# EAGLE design espcam (EAGLE 9.6.2)
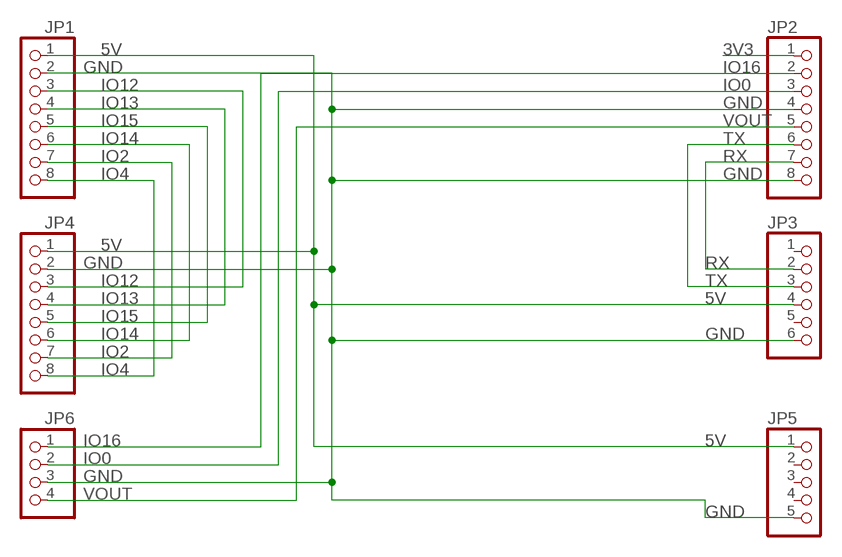
[diagram p0: schematic, sheet 1]

## Parts
JP1  PINHD-1X8  [1X08]
JP2  PINHD-1X8  [1X08]
JP3  PINHD-1X6  [1X06]
JP4  PINHD-1X8  [1X08]
JP5  PINHD-1X5  [1X05]
JP6  PINHD-1X4  [1X04]

## Nets
3V3: JP2.1
5V: JP1.1 JP3.4 JP4.1 JP5.1
GND: JP1.2 JP2.4 JP2.8 JP3.6 JP4.2 JP5.5 JP6.3
IO0: JP2.3 JP6.2
IO2: JP1.7 JP4.7
IO4: JP1.8 JP4.8
IO12: JP1.3 JP4.3
IO13: JP1.4 JP4.4
IO14: JP1.6 JP4.6
IO15: JP1.5 JP4.5
IO16: JP2.2 JP6.1
RX: JP2.7 JP3.2
TX: JP2.6 JP3.3
VOUT: JP2.5 JP6.4
Unconnected: JP3.1 JP3.5 JP5.2 JP5.3 JP5.4

## Library data of the parts
JP1 JP2 JP4 = pinhead:PINHD-1X8: PIN HEADER
JP3 = pinhead:PINHD-1X6: PIN HEADER
JP5 = pinhead:PINHD-1X5: PIN HEADER
JP6 = pinhead:PINHD-1X4: PIN HEADER

## Board
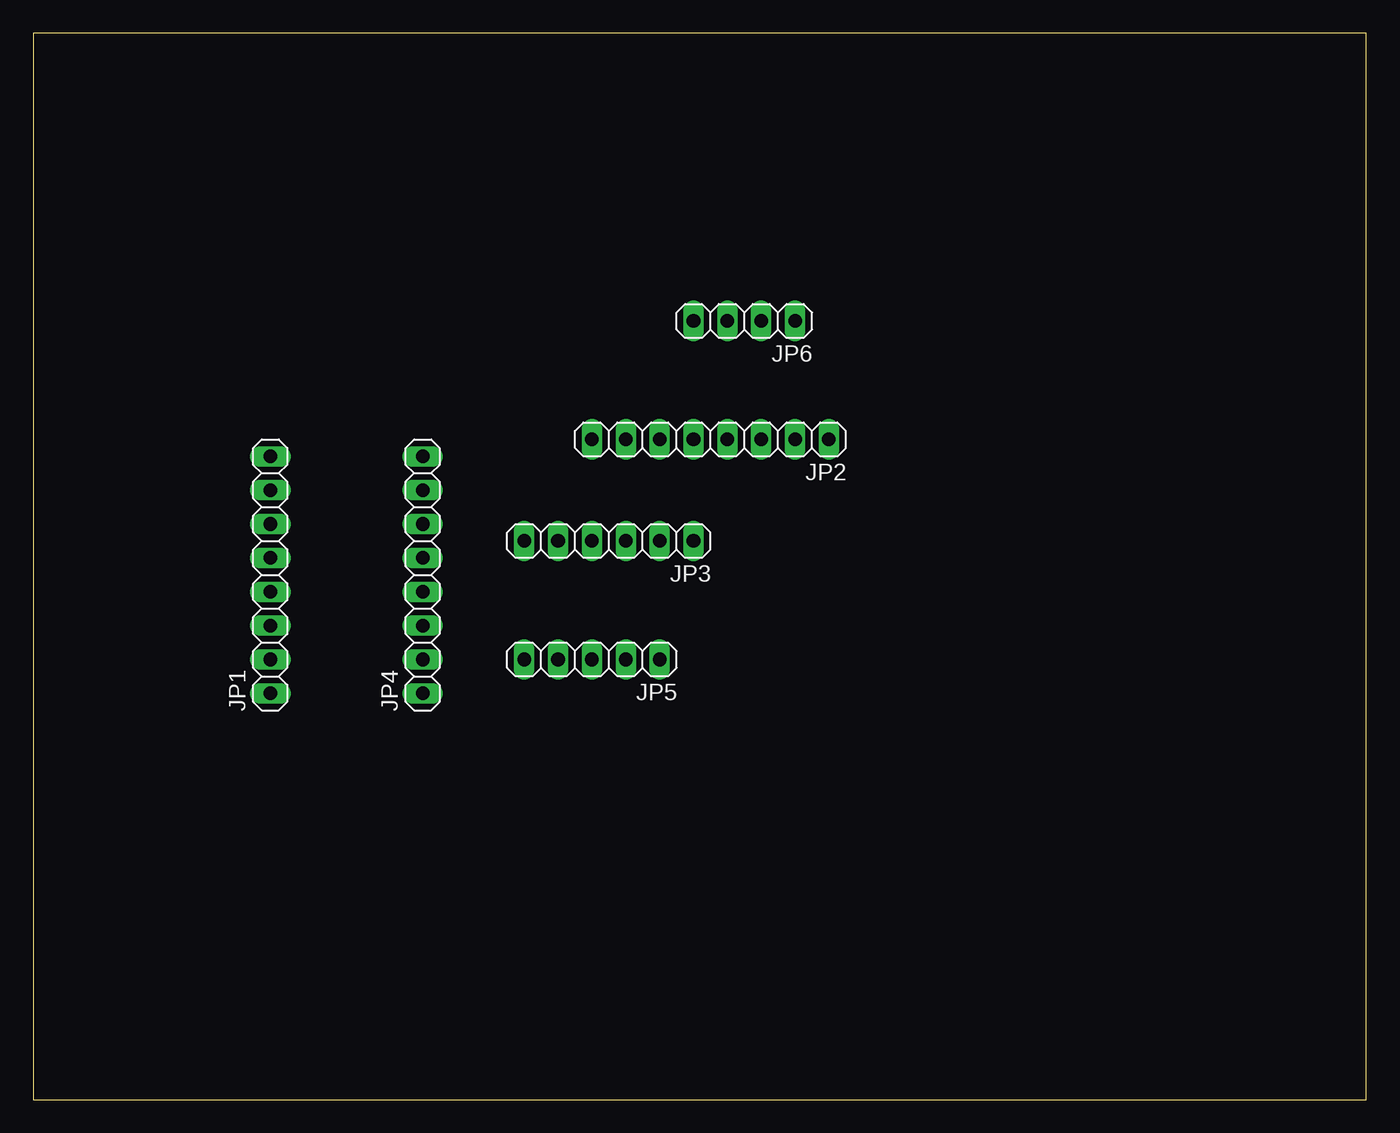
[diagram p1: board, top side]
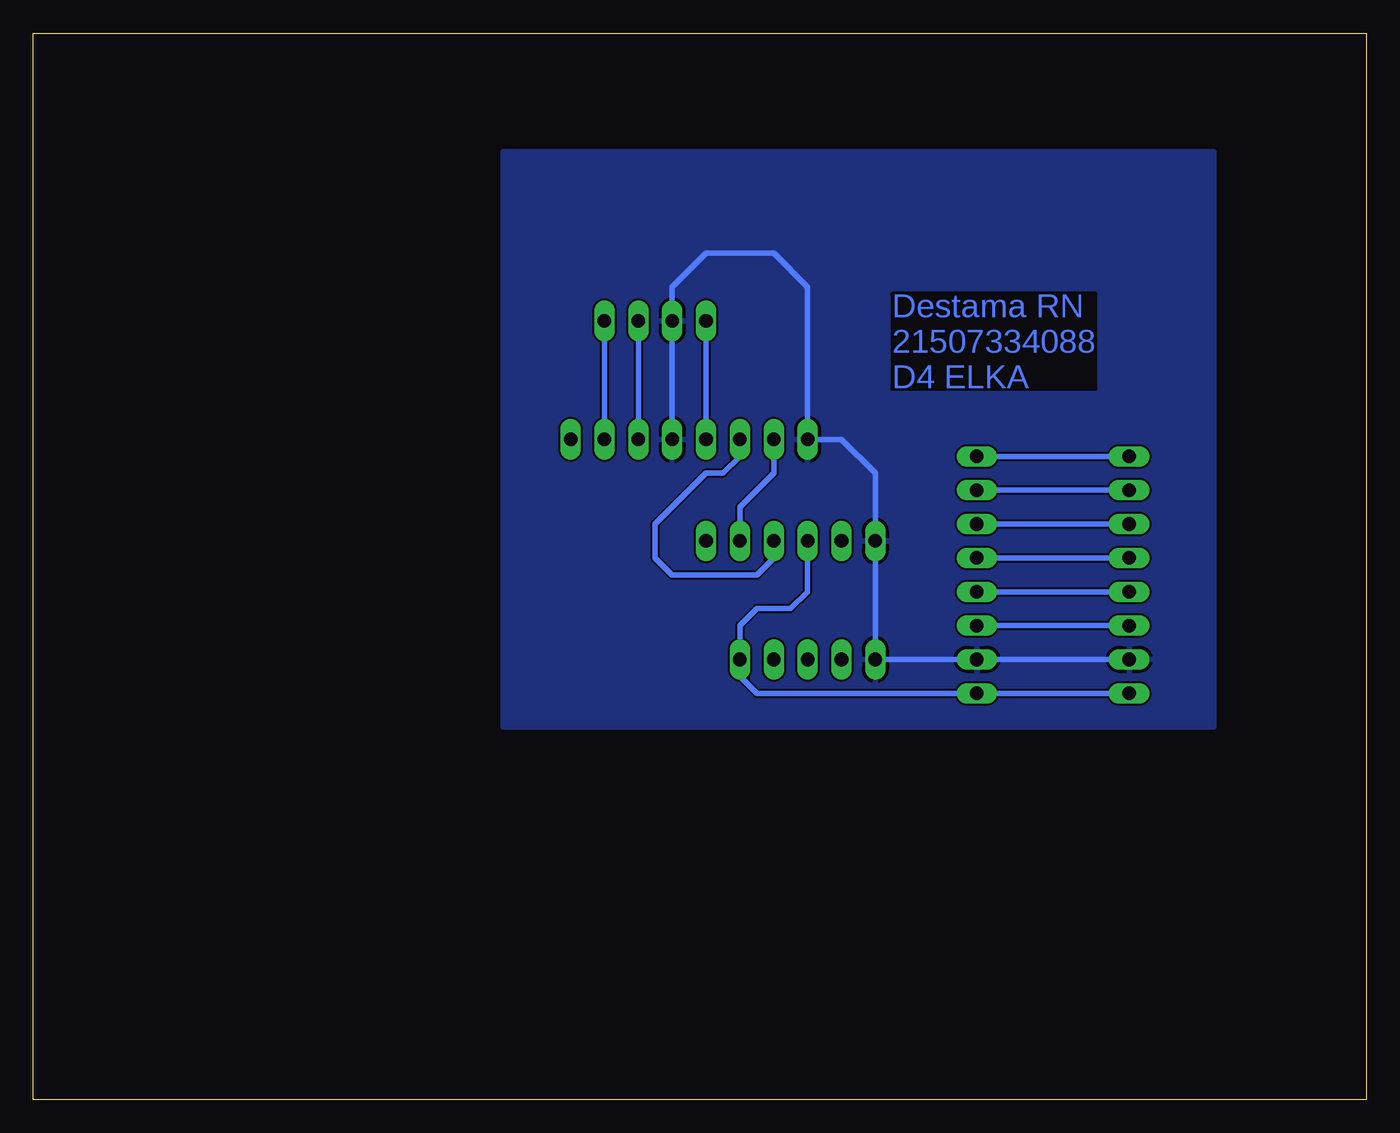
[diagram p2: board, bottom side, seen from below]

Size 100 x 80 mm. Coordinates in mm from the lower left corner, seen from the top.
Outline: 0,0 100,0 100,80 0,80 0,0
Copper layers (1*16): Top 0.035mm / dielectric 1.5mm / Bottom 0.035mm
Design rules "default": minimum track width 6mil, minimum drill 0.35mm, track to track 6mil, track to pad 6mil, pad to pad 6mil, via to via 6mil, smd to smd 6mil, copper to edge 40mil, drill to drill 6mil, minimum pad ring 10mil, minimum via ring 8mil, stop-mask expansion 4mil, vias tented up to drill 0mil, thermal gap 10mil

### Footprints (pad centres in the part's own frame; a part is rotated, then mirrored left to right if it is on the bottom)
1X08 = drill 1.016 long: 1 -8.89,0; 2 -6.35,0; 3 -3.81,0; 4 -1.27,0; 5 1.27,0; 6 3.81,0; 7 6.35,0; 8 8.89,0
1X06 = drill 1.016 long: 1 -6.35,0; 2 -3.81,0; 3 -1.27,0; 4 1.27,0; 5 3.81,0; 6 6.35,0
1X05 = drill 1.016 long: 1 -5.08,0; 2 -2.54,0; 3 0,0; 4 2.54,0; 5 5.08,0
1X04 = drill 1.016 long: 1 -3.81,0; 2 -1.27,0; 3 1.27,0; 4 3.81,0

### Placement (x,y rotation side)
JP1  17.78,39.37 90 top
JP2  50.8,49.53 180 top
JP3  43.18,41.91 180 top
JP4  29.21,39.37 90 top
JP5  41.91,33.02 180 top
JP6  53.34,58.42 180 top

### Tracks (layer width: path | path; a pad name or v marks a point on that pad's centre or on a via)
5V
  Bottom 0.406: JP1.1 JP4.1 45.72,30.48 46.99,31.75 JP5.1 46.99,35.56 45.72,36.83 43.18,36.83 41.91,38.1 JP3.4
GND
  Bottom 0.406: JP1.2 JP4.2 JP5.5 JP3.6 36.83,46.99 39.37,49.53 JP2.8 41.91,60.96 44.45,63.5 49.53,63.5 52.07,60.96 JP6.3 JP2.4
  pour Bottom: 11.43,71.12 11.43,27.94 64.77,27.94 64.77,71.12
IO0
  Bottom 0.406: JP2.3 JP6.2
IO2
  Bottom 0.406: JP1.7 JP4.7
IO4
  Bottom 0.406: JP1.8 JP4.8
IO12
  Bottom 0.406: JP1.3 JP4.3
IO13
  Bottom 0.406: JP1.4 JP4.4
IO14
  Bottom 0.406: JP1.6 JP4.6
IO15
  Bottom 0.406: JP1.5 JP4.5
IO16
  Bottom 0.406: JP2.2 JP6.1
RX
  Bottom 0.406: JP3.2 46.99,44.45 44.45,46.99 JP2.7
TX
  Bottom 0.406: JP3.3 44.45,40.64 45.72,39.37 52.07,39.37 53.34,40.64 53.34,43.18 49.53,46.99 48.26,46.99 46.99,48.26 JP2.6
VOUT
  Bottom 0.406: JP2.5 JP6.4

### Text on the board
Bottom: Destama RN / 21507334088 / D4 ELKA